# EAGLE design LED Trinket (EAGLE 9.6.2)
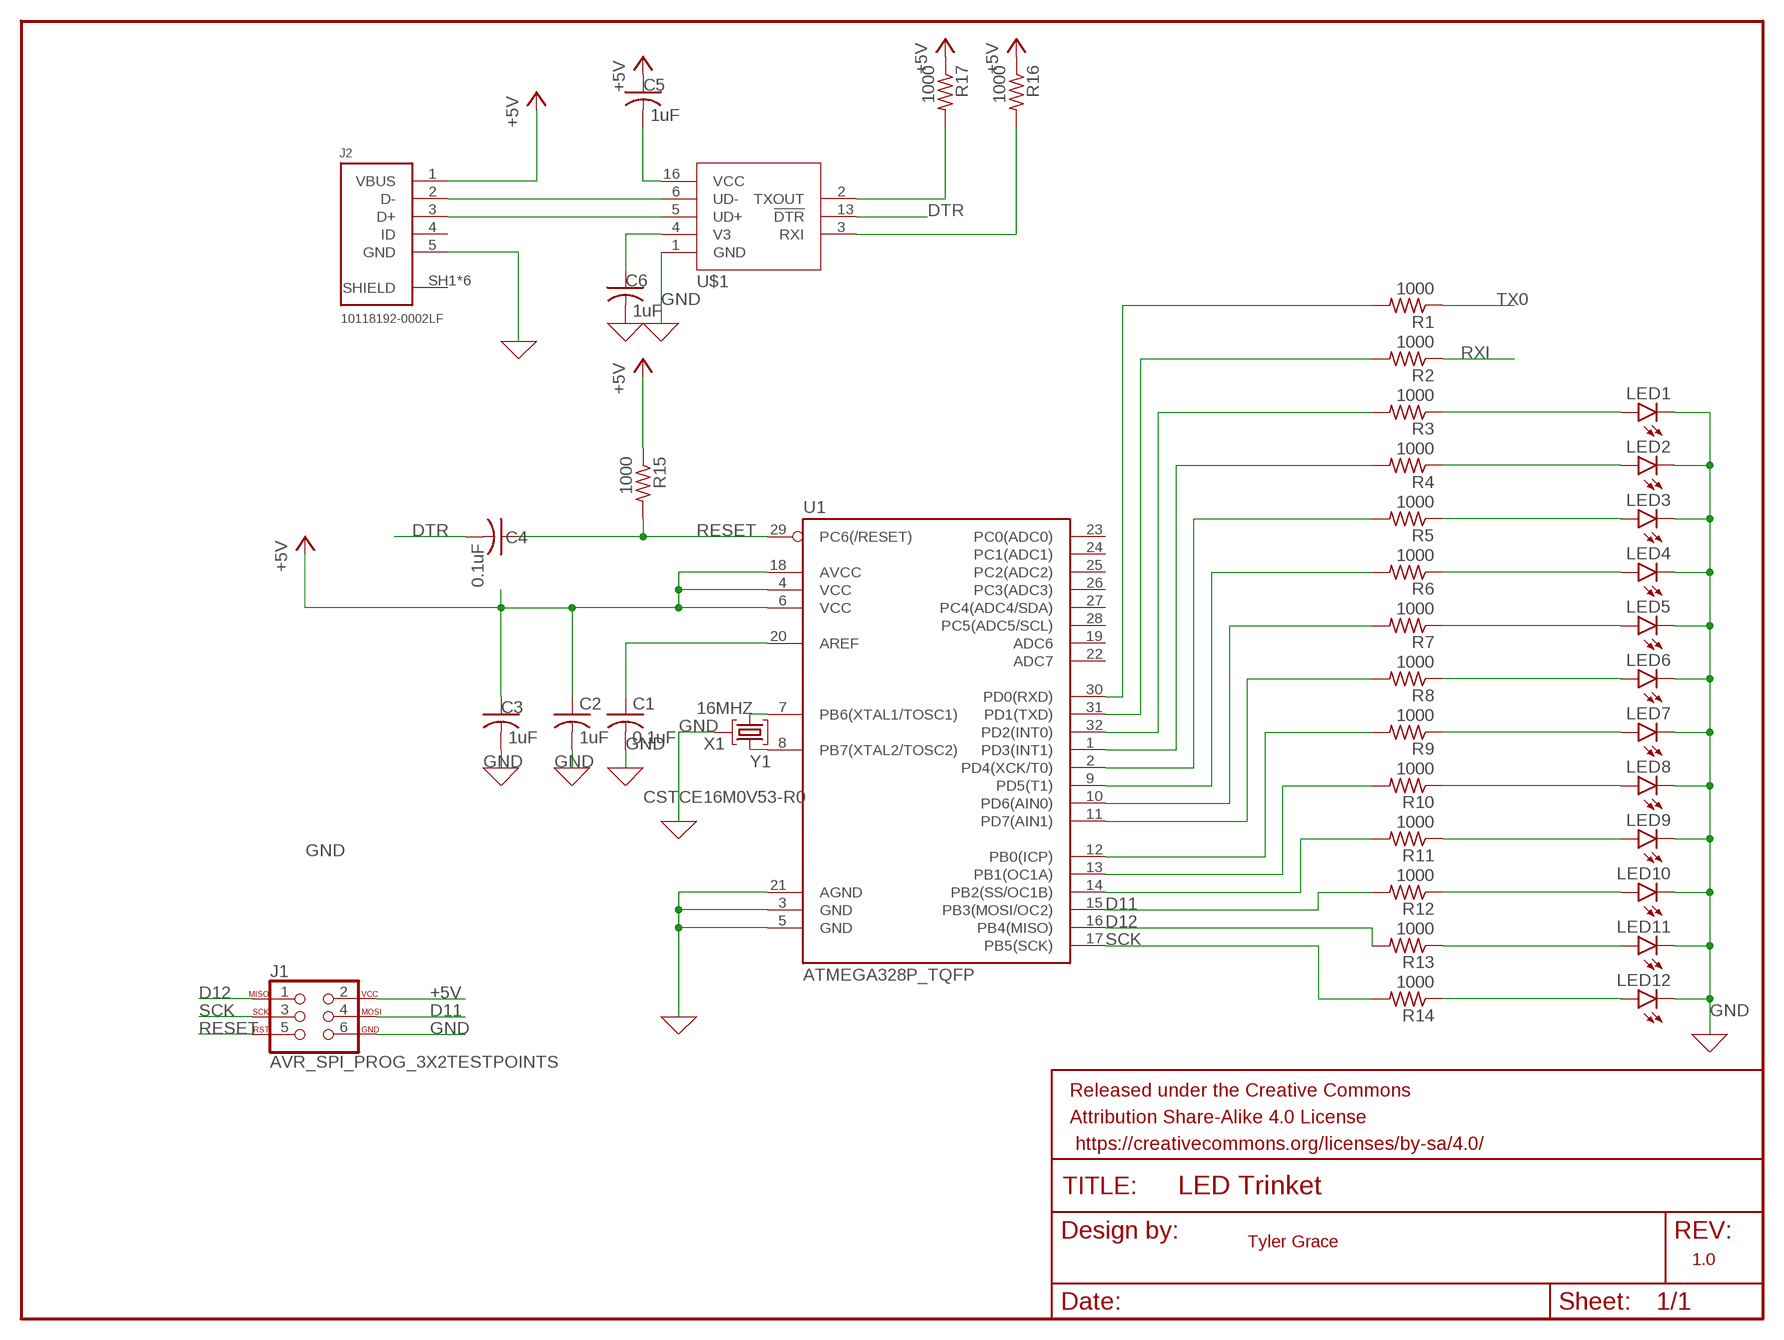
[diagram p0: schematic, sheet 1]

## Parts
C1  0.1uF  C-USC0805  [C0805]
C2  1uF  C-USC0805  [C0805]
C3  1uF  C-USC0805  [C0805]
C4  0.1uF  C-USC0805  [C0805]
C5  1uF  C-USC0805  [C0805]
C6  1uF  C-USC0805  [C0805]
FRAME1  FRAME-LETTERNO_PACKAGE  [DUMMY]
J1  AVR_SPI_PROG_3X2TESTPOINTS  [2X3_TEST_POINTS]
J2  10118192-0002LF  [10118192-0002LF]
LED1  LED  [SMARTLED-TTW]
LED2  LED  [SMARTLED-TTW]
LED3  LED  [SMARTLED-TTW]
LED4  LED  [SMARTLED-TTW]
LED5  LED  [SMARTLED-TTW]
LED6  LED  [SMARTLED-TTW]
LED7  LED  [SMARTLED-TTW]
LED8  LED  [SMARTLED-TTW]
LED9  LED  [SMARTLED-TTW]
LED10  LED  [SMARTLED-TTW]
LED11  LED  [SMARTLED-TTW]
LED12  LED  [SMARTLED-TTW]
R1  1000  R-US_R0805  [R0805]
R2  1000  R-US_R0805  [R0805]
R3  1000  R-US_R0805  [R0805]
R4  1000  R-US_R0805  [R0805]
R5  1000  R-US_R0805  [R0805]
R6  1000  R-US_R0805  [R0805]
R7  1000  R-US_R0805  [R0805]
R8  1000  R-US_R0805  [R0805]
R9  1000  R-US_R0805  [R0805]
R10  1000  R-US_R0805  [R0805]
R11  1000  R-US_R0805  [R0805]
R12  1000  R-US_R0805  [R0805]
R13  1000  R-US_R0805  [R0805]
R14  1000  R-US_R0805  [R0805]
R15  1000  R-US_R0805  [R0805]
R16  1000  R-US_R0805  [R0805]
R17  1000  R-US_R0805  [R0805]
U1  ATMEGA328P_TQFP  [TQFP32-08]
U$1  CH340C  [SOP-16]
X1  CSTCE16M0V53-R0  [CSTCE16M0V53-R0]

## Nets
0: C6.2 ; supply symbol labelled GND
16MHZ: U1.7(PB6(XTAL1/TOSC1)) X1.1(INPUT)
+5V: C2.1 C3.1 C5.1 J1.2 J2.1(VBUS) R15.1 R16.1 R17.1 U1.4(VCC) U1.6(VCC) U1.18(AVCC)
D11: J1.4 R12.2 U1.15(PB3(MOSI/OC2))
D12: J1.1 R13.2 U1.16(PB4(MISO))
DTR: C4.2 U$1.13(!DTR)
GND: C1.2 C2.2 C3.2 J1.6 J2.5(GND) LED1.C@1(C) LED2.C@1(C) LED3.C@1(C) LED4.C@1(C) LED5.C@1(C) LED6.C@1(C) LED7.C@1(C) LED8.C@1(C) LED9.C@1(C) LED10.C@1(C) LED11.C@1(C) LED12.C@1(C) U$1.1(GND) X1.2(GND)
GROUND: U1.3(GND) U1.5(GND) U1.21(AGND) ; supply symbol labelled GND
N$1: R1.2 U1.30(PD0(RXD))
N$2: R2.2 U1.31(PD1(TXD))
N$3: C1.1 U1.20(AREF)
N$4: J2.2(D-) U$1.6(UD-)
N$5: R3.2 U1.32(PD2(INT0))
N$6: R4.2 U1.1(PD3(INT1))
N$7: R5.2 U1.2(PD4(XCK/T0))
N$8: R6.2 U1.9(PD5(T1))
N$9: R7.2 U1.10(PD6(AIN0))
N$10: R8.2 U1.11(PD7(AIN1))
N$11: R9.2 U1.12(PB0(ICP))
N$12: R10.2 U1.13(PB1(OC1A))
N$13: R11.2 U1.14(PB2(SS/OC1B))
N$14: J2.3(D+) U$1.5(UD+)
N$15: C5.2 U$1.16(VCC)
N$16: C6.1 U$1.4(V3)
N$17: LED1.A@1(A) R3.1
N$18: LED2.A@1(A) R4.1
N$19: LED3.A@1(A) R5.1
N$20: LED4.A@1(A) R6.1
N$21: LED5.A@1(A) R7.1
N$22: LED6.A@1(A) R8.1
N$23: LED7.A@1(A) R9.1
N$24: LED8.A@1(A) R10.1
N$25: LED9.A@1(A) R11.1
N$26: LED10.A@1(A) R12.1
N$27: LED11.A@1(A) R13.1
N$28: LED12.A@1(A) R14.1
N$31: R17.2 U$1.2(TXOUT)
N$32: R16.2 U$1.3(RXI)
RESET: C4.1 J1.5 R15.2 U1.29(PC6(/RESET))
RXI: R2.1
SCK: J1.3 R14.2 U1.17(PB5(SCK))
TX0: R1.1
Y1: U1.8(PB7(XTAL2/TOSC2)) X1.3(OUTPUT)
Unconnected: J2.4(ID) U1.19(ADC6) U1.22(ADC7) U1.23(PC0(ADC0)) U1.24(PC1(ADC1)) U1.25(PC2(ADC2)) U1.26(PC3(ADC3)) U1.27(PC4(ADC4/SDA)) U1.28(PC5(ADC5/SCL))

## Notes on the sheet
- Tyler Grace
- 1.0

## Power pins joined to a net without a drawn wire
SHIELD: J2.SH1(SHIELD) J2.SH2(SHIELD) J2.SH3(SHIELD) J2.SH4(SHIELD) J2.SH5(SHIELD) J2.SH6(SHIELD)

## Library data of the parts
C1-C6 = rcl:C-US: CAPACITOR, American symbol; SPICEPREFIX: C
FRAME1 = SparkFun-Aesthetics:FRAME-LETTER: Schematic Frame - Letter Standard 8.5x11 US Letter frame; DESIGNER: Nobody; VERSION: v01
J1 = SparkFun-Connectors:AVR_SPI_PROG_3X2: AVR ISP 6 Pin This is the reduced ISP connector for AVR programming. Common on Arduino. This footprint will take up less PCB space and can be used with a 10-pin to 6-pin adapter such as SKU: BOB-08508 **Special note about "TEST_POINT" package. The stop mask is on the top side, so if you want your programming test points to be on the bottom of your board, make sure to place this package on the bottom side of the board. This also ensure that the orientation to program from the bottom side will be correct. SparkFun Products: SparkFun ISP Pogo Adapter <https://www.sparkfun.com/products/11591> - NS Tiny AVR Programmer <https://www.sparkfun.com/products/11801> -PTH
J2 = USB connector:10118192-0002LF: CONN RCPT USB2.0 MICRO B SMD R/A Manufacturer's datasheet <https://www.amphenol-icc.com/media/wysiwyg/files/drawing/10118192.pdf>; CREATED_BY: PCBLayout.com; DIGIKEY_PARTNO: 609-5379-2-ND; MANUFACTURER: Amphenol ICC (FCI); MPN: 10118192-0002LF
LED1-LED12 = led:LED: LED OSRAM: - CHIPLED LG R971, LG N971, LY N971, LG Q971, LY Q971, LO R971, LY R971 LH N974, LH R974 LS Q976, LO Q976, LY Q976 LO Q996 - Hyper CHIPLED LW Q18S LB Q993, LB Q99A, LB R99A - SideLED LS A670, LO A670, LY A670, LG A670, LP A670 LB A673, LV A673, LT A673, LW A673 LH A674 LY A675 LS A676, LA A676, LO A676, LY A676, LW A676 LS A679, LY A679, LG A679 - Hyper Micro SIDELED® LS Y876, LA Y876, LO Y876, LY Y876 LT Y87S - SmartLED LW L88C, LW L88S LB L89C, LB L89S, LG L890 LS L89K, LO L89K, LY L89K LS L896, LA L896, LO L896, LY L896 - TOPLED LS T670, LO T670, LY T670, LG T670, LP T670 LSG T670, LSP T670, LSY T670, LOP T670, LYG T670 LG T671, LOG T671, LSG T671 LB T673, LV T673, LT T673, LW T673 LH T674 LS T676, LA T676, LO T676, LY T676, LB T676, LH T676, LSB T676, LW T676 LB T67C, LV T67C, LT T67C, LS T67K, LO T67K, LY T67K, LW E67C LS E67B, LA E67B, LO E67B, LY E67B, LB E67C, LV E67C, LT E67C LW T67C LS T679, LY T679, LG T679 LS T770, LO T770, LY T770, LG T770, LP T770 LB T773, LV T773, LT T773, LW T773 LH T774 LS E675, LA E675, LY E675, LS T675 LS T776, LA T776, LO T776, LY T776, LB T776 LHGB T686 LT T68C, LB T68C - Hyper Mini TOPLED® LB M676 - Mini TOPLED Santana® LG M470 LS M47K, LO M47K, LY M47K Source: http://www.osram.convergy.de LUXEON: - LUMILED® LXK2-PW12-R00, LXK2-PW12-S00, LXK2-PW14-U00, LXK2-PW14-V00 LXK2-PM12-R00, LXK2-PM12-S00, LXK2-PM14-U00 LXK2-PE12-Q00, LXK2-PE12-R00, LXK2-PE12-S00, LXK2-PE14-T00, LXK2-PE14-U00 LXK2-PB12-K00, LXK2-PB12-L00, LXK2-PB12-M00, LXK2-PB14-N00, LXK2-PB14-P00, LXK2-PB14-Q00 LXK2-PR12-L00, LXK2-PR12-M00, LXK2-PR14-Q00, LXK2-PR14-R00 LXK2-PD12-Q00, LXK2-PD12-R00, LXK2-PD12-S00 LXK2-PH12-R00, LXK2-PH12-S00 LXK2-PL12-P00, LXK2-PL12-Q00, LXK2-PL12-R00 Source: www.luxeon.com KINGBRIGHT: KA-3528ASYC Source: www.kingbright.com
R1-R17 = rcl:R-US_: RESISTOR, American symbol; SPICEPREFIX: R
U1 = SparkFun-IC-Microcontroller:ATMEGA328P_TQFP: Popular 328P in QFP Storefront component: ATmega328 - TQFP <https://www.sparkfun.com/products/13448> (COM-13448) Datasheet <http://www.sparkfun.com/datasheets/Components/SMD/ATMega328.pdf> SparkFun Products SparkFun RedBoard - Programmed with Arduino <https://www.sparkfun.com/products/12757> (DEV-12757) Arduino Pro Mini 328 - 5V/16MHz <https://www.sparkfun.com/products/11113> (DEV-11113) Arduino Pro Mini 328 - 3.3V/8MHz <https://www.sparkfun.com/products/11114> (DEV-11114) SparkFun OpenLog <https://www.sparkfun.com/products/13712> (DEV-13712) SparkFun MicroView - OLED Arduino Module <https://www.sparkfun.com/products/12923> (DEV-12923) SparkFun Digital Sandbox <https://www.sparkfun.com/products/12651> (DEV-12651) SparkFun PicoBoard <https://www.sparkfun.com/products/11888> (WIG-11888) Arduino Fio <https://www.sparkfun.com/products/10116> (DEV-10116) LilyPad Arduino 328 Main Board <https://www.sparkfun.com/products/13342> (DEV-13342) SparkFun RedStick <https://www.sparkfun.com/products/13741> (DEV-13741) LilyPad MP3 <https://www.sparkfun.com/products/11013> (DEV-11013) LilyPad Arduino SimpleSnap <https://www.sparkfun.com/products/10941> (DEV-10941) SparkFun Stepoko <https://www.sparkfun.com/products/13899> (ROB-13899) SparkFun Geiger Counter <https://www.sparkfun.com/products/11345> (SEN-11345) SparkFun EL Sequencer <https://www.sparkfun.com/products/12781> (COM-12781) Arduino Pro 328 - 5V/16MHz <https://www.sparkfun.com/products/10915> (DEV-10915) CryptoCape <https://www.sparkfun.com/products/12773> (DEV-12773) SparkFun IR Thermometer Evaluation Board - MLX90614 <https://www.sparkfun.com/products/10740> (SEN-10740) SparkFun RedBot Mainboard <https://www.sparkfun.com/products/12097> (ROB-12097) Arduino Pro 328 - 3.3V/8MHz <https://www.sparkfun.com/products/10914> (DEV-10914) SparkFun Block for Intel® Edison - Arduino <https://www.sparkfun.com/products/13036> (DEV-13036) SparkFun Simon Says - Surface Mount Soldering Kit <https://www.sparkfun.com/products/10935> (KIT-10935) SparkFun 7-Segment Serial Display - Red <https://www.sparkfun.com/products/11441> (COM-11441) SparkFun 7-Segment Serial Display - White <https://www.sparkfun.com/products/11629> (COM-11629) SparkFun 7-Segment Serial Display - Yellow <https://www.sparkfun.com/products/11443> (COM-11443) SparkFun 7-Segment Serial Display - Kelly Green <https://www.sparkfun.com/products/11440> (COM-11440) SparkFun 7-Segment Serial Display - Blue <https://www.sparkfun.com/products/11442> (COM-11442) SparkFun OpenSegment Serial Display - 20mm (Blue) <https://www.sparkfun.com/products/11647> (COM-11647) SparkFun OpenSegment Serial Display - 20mm (Green) <https://www.sparkfun.com/products/11646> (COM-11646) SparkFun OpenSegment Serial Display - 20mm (White) <https://www.sparkfun.com/products/11648> (COM-11648) SparkFun OpenSegment Serial Display - 20mm (Red) <https://www.sparkfun.com/products/11644> (COM-11644) SparkFun OpenSegment Serial Display - 20mm (Yellow) <https://www.sparkfun.com/products/11645> (COM-11645) SparkFun OpenSegment Shield <https://www.sparkfun.com/products/13190> (DEV-13190); PROD_ID: IC-09069
U$1 = CH340:CH340C: CH340C USB TO UART IC
X1 = Crystals_Oscillators:CSTCE16M0V53-R0: CER RES 16.0000MHZ 15PF SMD Manufacturer's datasheet <https://www.murata.com/~/media/webrenewal/support/library/catalog/products/timingdevice/ceralock/p16e.ashx>; CREATED_BY: PCBLayout.com; DIGIKEY_PART_NUMBER: 490-1198-2-ND; MANUFACTURER: Murata Electronics North America; MPN: CSTCE16M0V53-R0; PACKAGE: SMD 3

## Board
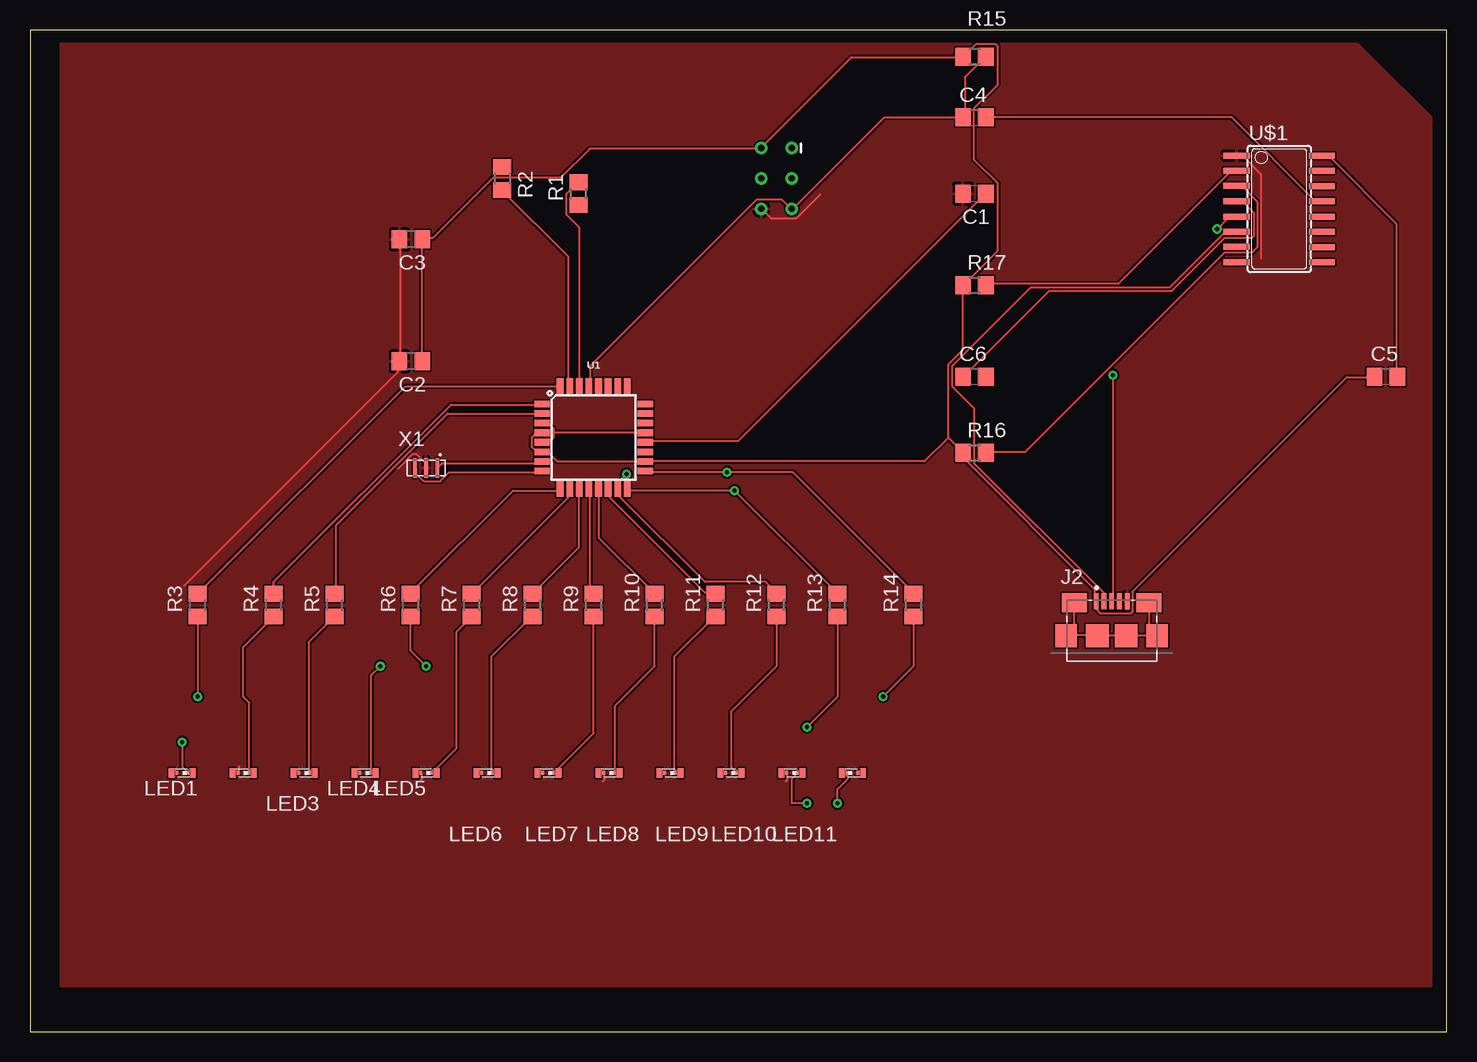
[diagram p1: board, top side]
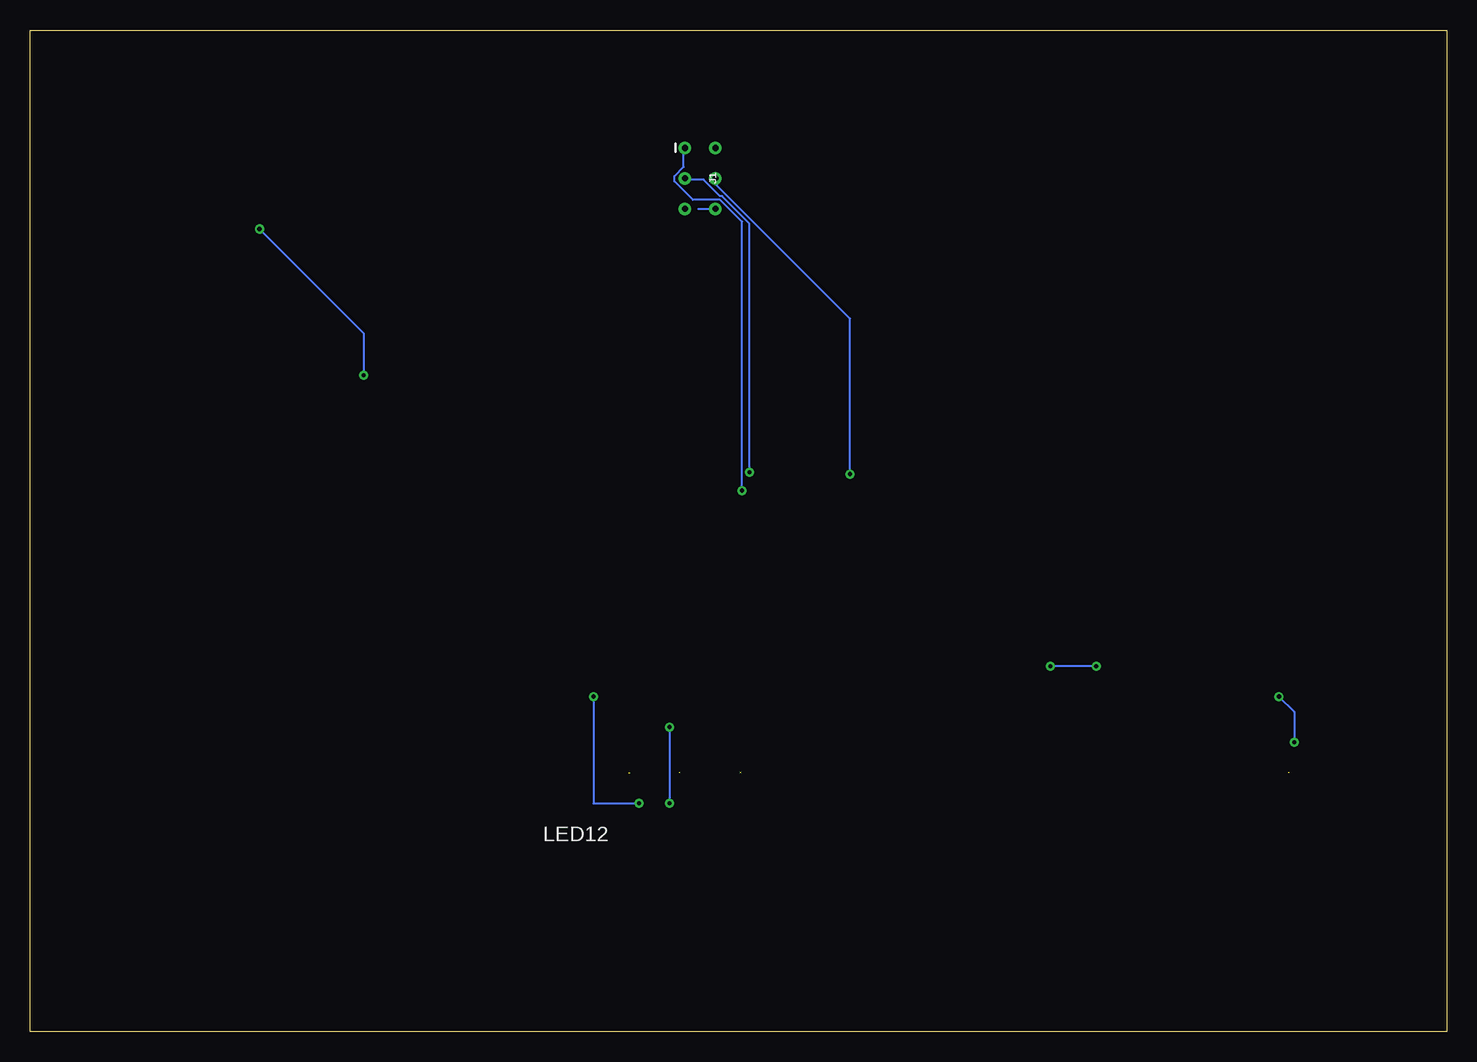
[diagram p2: board, bottom side, seen from below]

Size 118.09 x 83.49 mm. Coordinates in mm from the lower left corner, seen from the top.
Outline: 0,0 118.09,0 118.09,83.49 0,83.49 0,0
Copper layers (1*16): Top 0.035mm / dielectric 1.5mm / Bottom 0.035mm
Design rules "default": minimum track width 6mil, minimum drill 0.35mm, track to track 6mil, track to pad 6mil, pad to pad 6mil, via to via 6mil, smd to smd 6mil, copper to edge 40mil, drill to drill 6mil, minimum pad ring 10mil, minimum via ring 8mil, stop-mask expansion 4mil, vias tented up to drill 0mil, thermal gap 10mil

### Footprints (pad centres in the part's own frame; a part is rotated, then mirrored left to right if it is on the bottom)
C0805 = smd 1.3 x 1.5: 1 -0.95,0; 2 0.95,0
2X3_TEST_POINTS = drill 0.508: 1 -2.54,-1.27; 2 -2.54,1.27; 3 0,-1.27; 4 0,1.27; 5 2.54,-1.27; 6 2.54,1.27
10118192-0002LF = smd 0.4 x 1.35: 1 -1.3,2.875; 2 -0.65,2.875; 3 0,2.875; 4 0.65,2.875; 5 1.3,2.875 | smd 2.1 x 1.6: SH1 -3.1,2.75; SH2 3.1,2.75 | smd 1.8 x 1.9: SH3 -3.8,0; SH4 3.8,0 | smd 1.9 x 1.9: SH5 -1.2,0; SH6 1.2,0
SMARTLED-TTW = smd 0.8 x 0.5: A 0,-0.875; C 0,0.875 | smd 0.35 x 0.35: A@1 0,-0.5; C@1 0,0.5
R0805 = smd 1.3 x 1.5: 1 -0.95,0; 2 0.95,0
TQFP32-08 = smd 1.27 x 0.559: 1 -4.293,2.8; 2 -4.293,2; 3 -4.293,1.2; 4 -4.293,0.4; 5 -4.293,-0.4; 6 -4.293,-1.2; 7 -4.293,-2; 8 -4.293,-2.8; 17 4.293,-2.8; 18 4.293,-2; 19 4.293,-1.2; 20 4.293,-0.4; 21 4.293,0.4; 22 4.293,1.2; 23 4.293,2; 24 4.293,2.8 | smd 0.559 x 1.27: 9 -2.8,-4.293; 10 -2,-4.293; 11 -1.2,-4.293; 12 -0.4,-4.293; 13 0.4,-4.293; 14 1.2,-4.293; 15 2,-4.293; 16 2.8,-4.293; 25 2.8,4.293; 26 2,4.293; 27 1.2,4.293; 28 0.4,4.293; 29 -0.4,4.293; 30 -1.2,4.293; 31 -2,4.293; 32 -2.8,4.293
SOP-16 = smd 0.5 x 2.2: 1 -4.445,-3.55; 2 -3.185,-3.55; 3 -1.915,-3.55; 4 -0.645,-3.55; 5 0.635,-3.55; 6 1.895,-3.55; 7 3.165,-3.55; 8 4.435,-3.55; 9 4.445,3.55; 10 3.175,3.55; 11 1.905,3.55; 12 0.635,3.55; 13 -0.635,3.55; 14 -1.905,3.55; 15 -3.175,3.55; 16 -4.445,3.55
CSTCE16M0V53-R0 = smd 0.3 x 1.6: 1 0.95,0; 2 0,0; 3 -0.95,0

### Placement (x,y rotation side)
C1  78.74,69.85 180 top
C2  31.75,55.88 180 top
C3  31.75,66.04 180 top
C4  78.74,76.2 0 top
C5  113.03,54.61 0 top
C6  78.74,54.61 0 top
FRAME1  -19.05,73.66 0 top  (outside the outline)
J1  62.23,71.12 270 bottom
J2  90.17,33.02 0 top
LED1  12.7,21.59 90 top
LED2  17.78,21.59 90 top
LED3  22.86,21.59 90 top
LED4  27.94,21.59 90 top
LED5  33.02,21.59 90 top
LED6  38.1,21.59 90 top
LED7  43.18,21.59 90 top
LED8  48.26,21.59 90 top
LED9  53.34,21.59 90 top
LED10  58.42,21.59 90 top
LED11  63.5,21.59 90 top
LED12  68.58,21.59 270 top
R1  45.72,69.85 90 top
R2  39.37,71.12 270 top
R3  13.97,35.56 90 top
R4  20.32,35.56 90 top
R5  25.4,35.56 90 top
R6  31.75,35.56 90 top
R7  36.83,35.56 90 top
R8  41.91,35.56 90 top
R9  46.99,35.56 90 top
R10  52.07,35.56 90 top
R11  57.15,35.56 90 top
R12  62.23,35.56 90 top
R13  67.31,35.56 90 top
R14  73.66,35.56 90 top
R15  78.74,81.28 0 top
R16  78.74,48.26 0 top
R17  78.74,62.23 0 top
U1  46.99,49.53 0 top
U$1  104.14,68.58 270 top
X1  33.02,46.99 0 top

### Tracks (layer width: path | path; a pad name or v marks a point on that pad's centre or on a via)
16MHZ
  Top 0.152: U1.7 42.57,47.4 34.34,47.4 34.04,47.09 X1.1
+5V
  Top 0.152: C2.1 32.66,55.93 32.66,65.99 C3.1 32.82,66.14 33.58,66.14 38.61,71.17 44.25,71.17 46.68,73.61 60.86,73.61 J1.2 61.01,73.76 68.48,81.23 77.78,81.23 R15.1 77.93,81.38 78.84,82.3 80.52,82.3 80.67,82.14 80.67,78.94 78.69,76.96 78.69,72.69 80.67,70.71 80.67,65.08 77.93,62.33 R17.1 77.78,62.18 77.78,56.84 76.56,55.63 76.56,49.53 | U1.4 42.57,49.84 42.11,49.84 41.81,49.53 41.81,48.77 42.11,48.46 42.57,48.46 U1.6 42.72,48.31 43.18,48.31 43.94,47.55 51.26,47.55 U1.18 51.41,47.55 74.57,47.55 76.56,49.53 | 76.56,49.53 77.78,48.31 R16.1 77.93,48.16 77.93,47.7 88.75,36.88 88.75,35.97 J2.1 88.9,35.81 88.9,35.2 89.21,34.9 91.8,34.9 91.95,35.05 91.95,36.73 109.78,54.56 112.06,54.56 C5.1
D11  (via drill 0.35)
  Top 0.152: R12.2 62.23,36.58 61.32,37.49 56.29,37.49 49.12,44.65 49.12,45.11 U1.15 49.12,45.26 49.12,45.87 v49.73,46.48
  Bottom 0.152: v49.73,46.48 49.73,59.44 60.86,70.56 60.86,71.02 J1.4
D12  (via drill 0.35)
  Top 0.152: U1.16 49.89,45.11 v58.73,45.11 67.26,36.58 R13.2
  Bottom 0.152: v58.73,45.11 58.73,67.51 60.55,69.34 62.84,69.34 64.36,70.87 64.36,71.32 63.6,72.08 63.6,73.61 J1.1
DTR
  Top 0.152: C4.2 100.18,76.2 107.04,69.34 107.65,69.34 U$1.13
GND
  Top 0.152: 65.89,69.8 63.91,67.82 61.77,67.82 61.01,68.58 J1.6 | 77.78,69.8 C1.2 | 102.62,64.47 102.62,71.48 101.09,73 100.64,73 U$1.1 | 91.49,35.97 J2.5 | C3.2 30.84,65.99 30.84,55.93 C2.2 30.68,55.78 30.68,55.02 12.85,37.19 | 63.14,21.64 LED11.C@1 63.14,21.49 63.14,21.03 62.99,20.88 | 68.94,21.64 LED12.C@1 | 32.51,20.88 32.66,21.03 32.66,21.49 LED5.C@1 | 17.42,21.49 LED2.C@1 17.42,21.64 17.42,22.1 | 47.75,20.88 47.9,21.03 47.9,21.49 LED8.C@1 | 30.68,46.94 31.9,48.16 32.21,48.16 32.97,47.4 32.97,47.09 X1.2
  Bottom 0.152: 62.38,68.58 J1.6
  pour Top: 2.54,81.28 2.54,3.81 116.84,3.81 116.84,76.2 111.76,81.28 110.49,82.55 2.54,82.55
GROUND
  Top 0.152: 43.64,49.99 43.64,50.29 43.33,50.6 42.72,50.6 U1.3 | 43.64,49.99 43.64,49.53 43.33,49.23 42.72,49.23 U1.5 | 43.64,49.99 51.26,49.99 U1.21
N$1
  Top 0.152: U1.30 45.77,53.95 45.77,67.06 44.7,68.12 44.7,69.8 45.62,70.71 R1.2
N$2
  Top 0.152: U1.31 44.86,53.95 44.86,64.62 39.37,70.1 R2.2
N$3
  Top 0.152: U1.20 51.41,49.23 59.03,49.23 79.6,69.8 C1.1
N$4
  Top 0.152: J2.2 89.51,35.97 89.51,36.58 78.69,47.4 78.69,51.97 76.86,53.8 76.86,55.47 83.41,62.03 95,62.03 99.57,66.6 100.48,66.6 U$1.6
N$5
  Top 0.152: U1.32 44.09,53.8 31.29,53.8 14.07,36.58 R3.2
N$6
  Top 0.152: R4.2 20.32,37.49 35.1,52.27 42.57,52.27 U1.1
N$7
  Top 0.152: U1.2 42.57,51.51 34.8,51.51 25.5,42.22 25.5,36.58 R5.2
N$8
  Top 0.152: U1.9 44.09,45.11 40.28,45.11 31.75,36.58 R6.2
N$9
  Top 0.152: U1.10 44.86,45.11 44.86,44.5 36.93,36.58 R7.2
N$10
  Top 0.152: U1.11 45.77,45.11 45.77,40.39 41.96,36.58 R8.2
N$11
  Top 0.152: U1.12 46.68,45.11 46.68,36.88 46.99,36.58 R9.2
N$12
  Top 0.152: U1.13 47.45,45.11 47.45,41.15 52.02,36.58 R10.2
N$13
  Top 0.152: U1.14 48.21,45.11 48.21,44.65 56.29,36.58 57.05,36.58 R11.2
N$14  (via drill 0.35)
  Top 0.152: v90.27,54.71 90.27,35.97 J2.3 | v98.96,66.9 99.87,67.82 100.48,67.82 U$1.5
  Bottom 0.152: v90.27,54.71 90.27,58.22 v98.96,66.9
N$15
  Top 0.152: C5.2 113.89,54.71 113.89,67.36 108.25,73 107.8,73 U$1.16
N$16
  Top 0.152: C6.1 77.93,54.71 84.94,61.72 95.15,61.72 99.57,66.14 101.85,66.14 102.01,66.29 102.01,68.28 101.09,69.19 100.64,69.19 U$1.4
N$17  (via drill 0.35)  (1 unrouted)
  Top 0.152: R3.1 v13.97,27.94 | v12.7,24.13 12.7,22.09 13.1,21.69 13.1,21.59
  Bottom 0.152: v13.97,27.94 12.7,26.67 v12.7,24.13
N$18
  Top 0.152: LED2.A@1 18.28,27.44 17.78,27.94 17.78,32.07 R4.1
N$19
  Top 0.152: LED3.A@1 23.22,21.64 23.22,32.46 25.35,34.59 R5.1
N$20  (via drill 0.35)
  Top 0.152: LED4.A@1 28.44,29.71 v29.21,30.48 | v33.02,30.48 31.75,31.75 R6.1
  Bottom 0.152: v29.21,30.48 v33.02,30.48
N$21
  Top 0.152: LED5.A@1 35.56,23.63 35.56,33.34 R7.1
N$22
  Top 0.152: LED6.A@1 38.46,21.64 38.46,31.24 41.81,34.59 R8.1
N$23
  Top 0.152: LED7.A@1 46.99,24.9 R9.1
N$24
  Top 0.152: LED8.A@1 48.76,27.17 52.07,30.48 R10.1
N$25
  Top 0.152: LED9.A@1 53.7,21.64 53.7,31.24 57.05,34.59 R11.1
N$26  (1 unrouted)
  Top 0.152: R12.1 62.23,30.48 58.42,26.67 58.42,22.09 58.82,21.69 58.82,21.59
N$27  (via drill 0.35)  (1 unrouted)
  Top 0.152: R13.1 67.31,27.94 v64.77,25.4 | v64.77,19.05 63.5,19.05 63.5,21.09 63.9,21.49 63.9,21.59
  Bottom 0.152: v64.77,25.4 v64.77,19.05
N$28  (via drill 0.35)  (1 unrouted)
  Top 0.152: R14.1 73.66,30.48 v71.12,27.94 | 68.18,21.59 68.18,21.09 67.31,20.22 v67.31,19.05
  Bottom 0.152: v71.12,27.94 71.12,19.05 v67.31,19.05
N$31
  Top 0.152: R17.2 79.76,62.33 90.73,62.33 100.03,71.63 100.48,71.63 U$1.2
N$32
  Top 0.152: R16.2 79.76,48.31 82.96,48.31 99.57,64.92 101.85,64.92 102.31,65.38 102.31,69.19 101.09,70.41 100.64,70.41 U$1.3
RESET
  Top 0.152: R15.2 79.6,81.23 77.93,79.55 77.93,76.2 C4.1 71.22,76.2 63.6,68.58 J1.5 63.45,68.58 62.69,69.34 60.55,69.34 46.68,55.47 46.68,53.95 U1.29
SCK  (via drill 0.35)
  Top 0.152: U1.17 51.41,46.63 v58.12,46.63 63.6,46.63 73.66,36.58 R14.2
  Bottom 0.152: v58.12,46.63 58.12,67.36 60.4,69.65 60.55,69.65 61.93,71.02 63.45,71.02 J1.3
SHIELD
  Top 0.152: 87.07,33.07 88.9,33.07 J2.SH5 89.05,33.07 91.34,33.07 J2.SH6 91.49,33.07 93.32,33.07 | 87.07,33.07 86.46,33.07 J2.SH3 87.07,33.07 | 93.32,33.07 93.93,33.07 J2.SH4 93.32,33.07 | 87.07,33.07 87.07,35.66 J2.SH1 | 93.32,33.07 93.32,35.66 J2.SH2
Y1
  Top 0.152: U1.8 42.57,46.63 34.95,46.63 34.19,45.87 32.82,45.87 32.21,46.48 32.21,46.94 X1.3